# EAGLE design geiger2 (EAGLE 9.4.1)
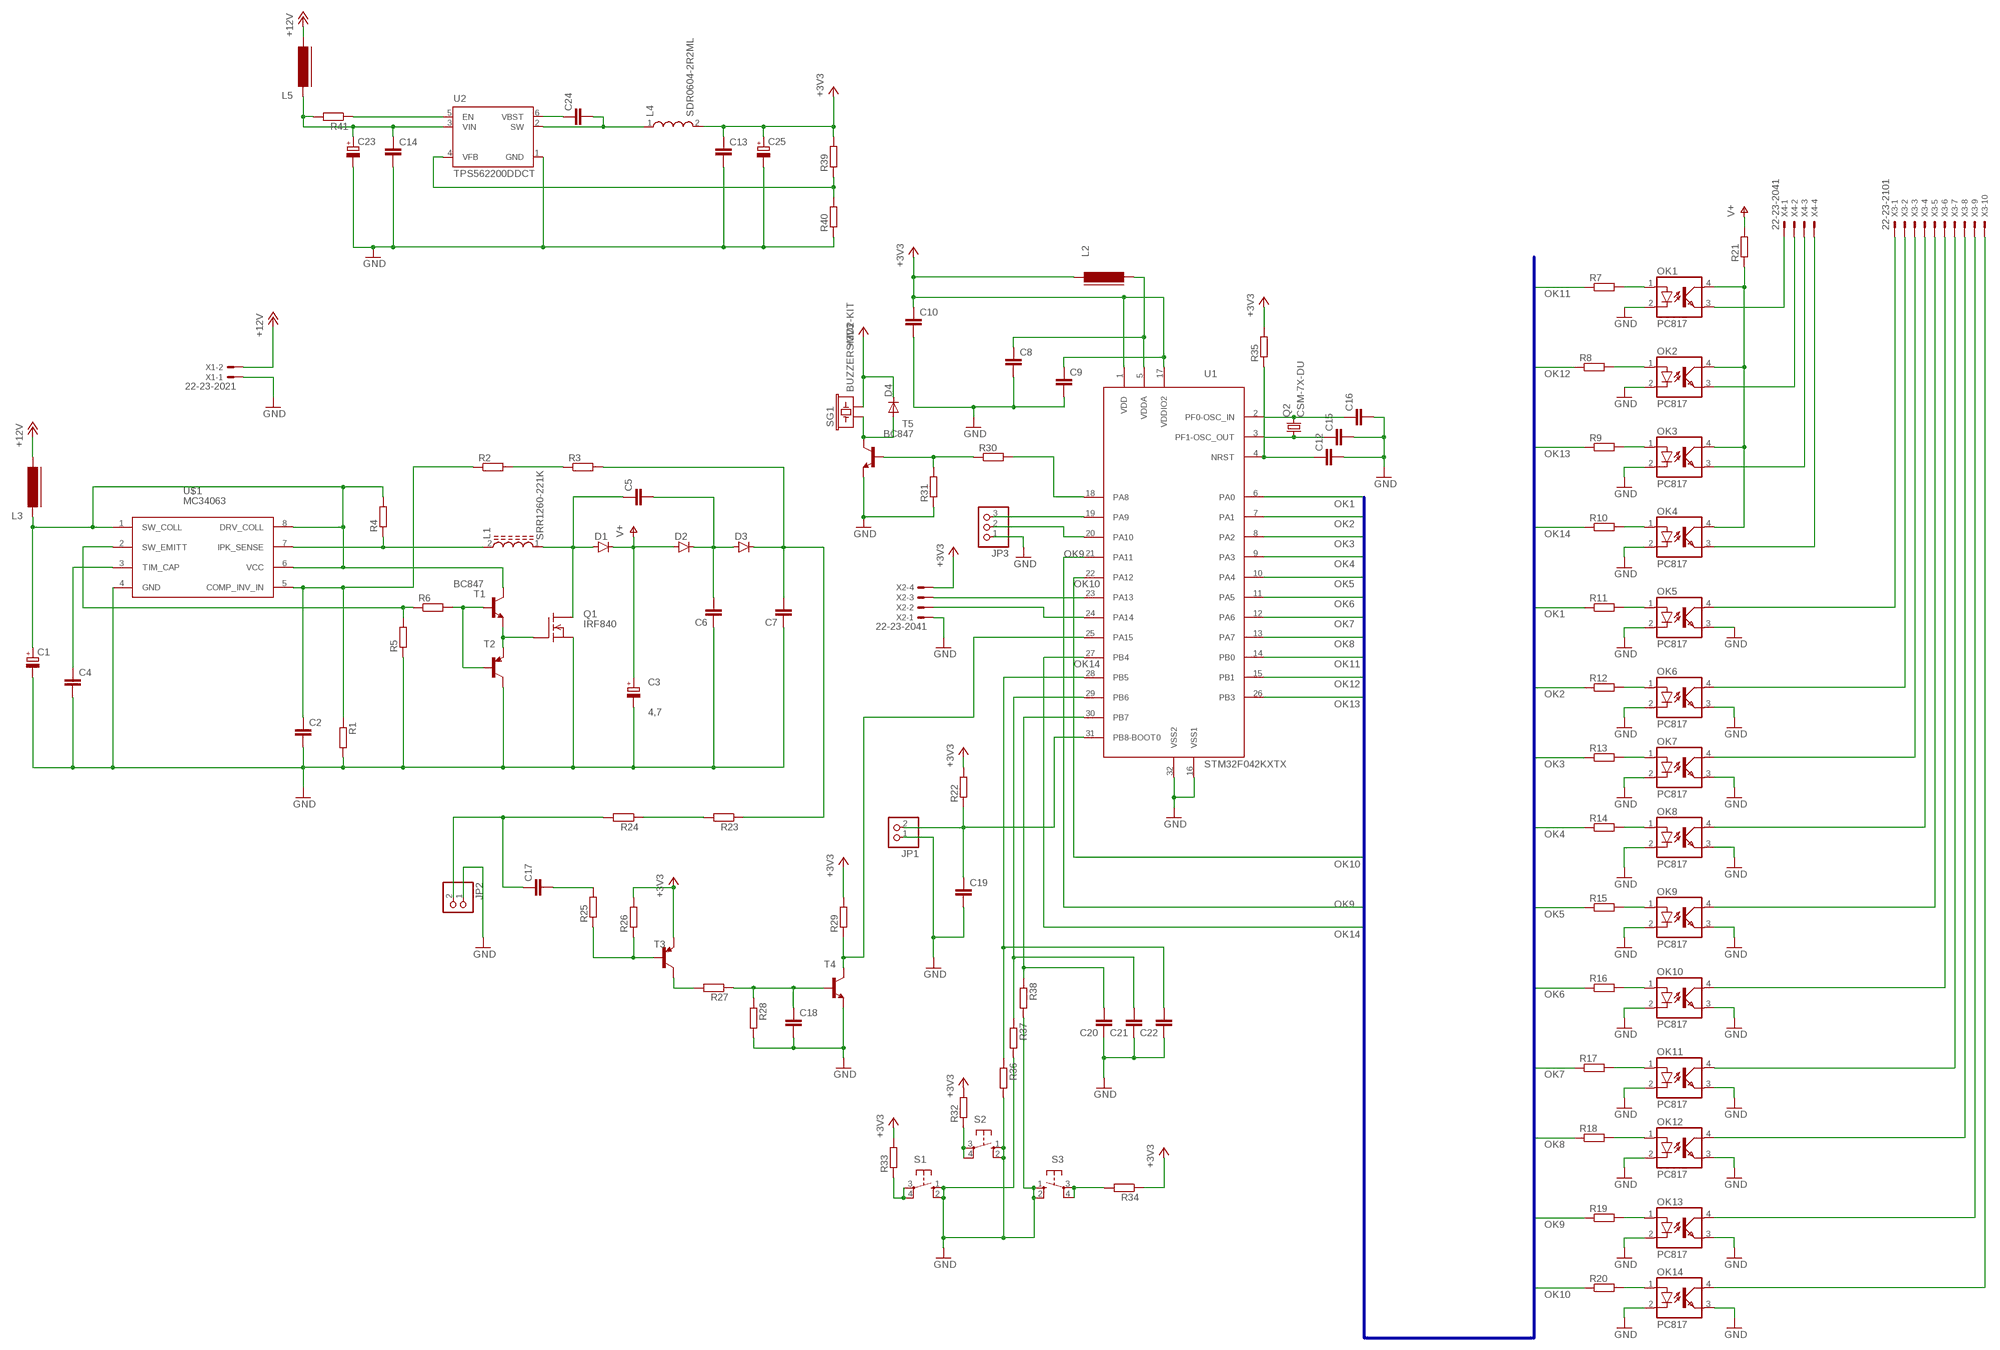
[diagram p0: schematic, sheet 1]

## Parts
C1  CPOL-EUCT7343  [CT7343]
C2  C-EUC0805  [C0805]
C3  4,7  CPOL-EUE5-10.5  [E5-10,5]
C4  C-EUC0805  [C0805]
C5  C-EUC1812K  [C1812K]
C6  C-EUC1812K  [C1812K]
C7  C-EUC1812K  [C1812K]
C8  C-EUC0805  [C0805]
C9  C-EUC0805  [C0805]
C10  C-EUC0805  [C0805]
C12  C-EUC0805  [C0805]
C13  C-EUC0805  [C0805]
C14  C-EUC0805  [C0805]
C15  C-EUC0805  [C0805]
C16  C-EUC0805  [C0805]
C17  C-EUC1206K  [C1206K]
C18  C-EUC0805K  [C0805K]
C19  C-EUC0805K  [C0805K]
C20  C-EUC0805K  [C0805K]
C21  C-EUC0805K  [C0805K]
C22  C-EUC0805K  [C0805K]
C23  CPOL-EUCT7343  [CT7343]
C24  C-EUC0805  [C0805]
C25  CPOL-EUCT7343  [CT7343]
D1  DIODE-DO214AC  [DO214AC]
D2  DIODE-DO214AC  [DO214AC]
D3  DIODE-DO214AC  [DO214AC]
D4  DIODE-SOD-123  [SOD-123]
JP1  PINHD-1X2  [1X02]
JP2  PINHD-1X2  [1X02]
JP3  PINHD-1X3  [1X03]
L1  SRR1260-221K  [INDP125125X600N]
L2  FERRITE-0805  [FB805]
L3  FERRITE-0805  [FB805]
L4  SDR0604-2R2ML  [INDP5858X480N]
L5  FERRITE-0805  [FB805]
OK1  PC817  [DIL04]
OK2  PC817  [DIL04]
OK3  PC817  [DIL04]
OK4  PC817  [DIL04]
OK5  PC817  [DIL04]
OK6  PC817  [DIL04]
OK7  PC817  [DIL04]
OK8  PC817  [DIL04]
OK9  PC817  [DIL04]
OK10  PC817  [DIL04]
OK11  PC817  [DIL04]
OK12  PC817  [DIL04]
OK13  PC817  [DIL04]
OK14  PC817  [DIL04]
Q1  IRF840  [TO220]
Q2  CSM-7X-DU  [CSM-7X-DU]
R1  R-EU_R0805  [R0805]
R2  R-EU_R0805  [R0805]
R3  R-EU_R0805  [R0805]
R4  R-EU_R2512  [R2512]
R5  R-EU_R0805  [R0805]
R6  R-EU_R0805  [R0805]
R7  R-EU_R0805  [R0805]
R8  R-EU_R0805  [R0805]
R9  R-EU_R0805  [R0805]
R10  R-EU_R0805  [R0805]
R11  R-EU_R0805  [R0805]
R12  R-EU_R0805  [R0805]
R13  R-EU_R0805  [R0805]
R14  R-EU_R0805  [R0805]
R15  R-EU_R0805  [R0805]
R16  R-EU_R0805  [R0805]
R17  R-EU_R0805  [R0805]
R18  R-EU_R0805  [R0805]
R19  R-EU_R0805  [R0805]
R20  R-EU_R0805  [R0805]
R21  R-EU_R1206  [R1206]
R22  R-EU_R0805  [R0805]
R23  R-EU_R1206  [R1206]
R24  R-EU_R1206  [R1206]
R25  R-EU_R0805  [R0805]
R26  R-EU_R0805  [R0805]
R27  R-EU_R0805  [R0805]
R28  R-EU_R0805  [R0805]
R29  R-EU_R0805  [R0805]
R30  R-EU_R0805  [R0805]
R31  R-EU_R0805  [R0805]
R32  R-EU_R0805  [R0805]
R33  R-EU_R0805  [R0805]
R34  R-EU_R0805  [R0805]
R35  R-EU_R0805  [R0805]
R36  R-EU_R0805  [R0805]
R37  R-EU_R0805  [R0805]
R38  R-EU_R0805  [R0805]
R39  R-EU_R0805  [R0805]
R40  R-EU_R0805  [R0805]
R41  R-EU_R0805  [R0805]
S1  10-XX  [B3F-10XX]
S2  10-XX  [B3F-10XX]
S3  10-XX  [B3F-10XX]
SG1  BUZZERSMD2-KIT  [BUZZER-CCV-KIT]
T1  BC847  BC847BLT1SMD  [SOT23]
T2  BC857C-PNP-SOT23-BEC  [SOT23-BEC]
T3  BC857A-PNP-SOT23-BEC  [SOT23-BEC]
T4  BC847-NPN-SOT23-BEC  [SOT23-BEC]
T5  BC847  [SOT23]
U1  STM32F042KXTX  [LQFP32]
U2  TPS562200DDCT  [SOT95P280X110-6N]
U$1  MC34063  MC34063/MC33063  [SO-8]
X1  22-23-2021  [22-23-2021]
X2  22-23-2041  [22-23-2041]
X3  22-23-2101  [22-23-2101]
X4  22-23-2041  [22-23-2041]

## Nets
+3V3: C9.1 C10.1 C13.1 C25.+ D4.C L2.1 L4.2 R22.2 R26.2 R29.2 R32.2 R33.2 R34.1 R35.2 R39.2 SG1.- T3.E U1.1(VDD) U1.17(VDDIO2) X2.4
+12V: L3.2 L5.2 X1.2
GND: C1.- C2.2 C3.- C4.2 C6.1 C7.1 C8.2 C9.2 C10.2 C12.2 C13.2 C14.2 C15.2 C16.2 C18.2 C19.2 C20.1 C21.1 C22.1 C23.- C25.- JP1.1 JP2.1 JP3.1 OK1.2(C) OK2.2(C) OK3.2(C) OK4.2(C) OK5.2(C) OK5.3(EMIT) OK6.2(C) OK6.3(EMIT) OK7.2(C) OK7.3(EMIT) OK8.2(C) OK8.3(EMIT) OK9.2(C) OK9.3(EMIT) OK10.2(C) OK10.3(EMIT) OK11.2(C) OK11.3(EMIT) OK12.2(C) OK12.3(EMIT) OK13.2(C) OK13.3(EMIT) OK14.2(C) OK14.3(EMIT) Q1.3(S) R1.2 R5.1 R28.2 R31.1 R36.2 R37.2 R38.2 R40.1 S1.1(S) S1.2(S1) S2.1(S) S2.2(S1) S3.1(S) S3.2(S1) T2.C T4.E T5.2(E) U1.16(VSS1) U1.32(VSS2) U2.1(GND) U$1.4(GND) X1.1 X2.1
N$1: C2.1 R1.1 R2.1 U$1.5(COMP_INV_IN)
N$2: C7.2 D3.C R3.2 R23.1
N$3: R6.2 T1.1(B) T2.B
N$4: R5.2 R6.1 U$1.2(SW_EMITT)
N$5: L1.2 R4.1 U$1.7(IPK_SENSE)
N$6: Q1.1(G) T1.2(E) T2.E
N$7: C5.1 D1.A L1.1 Q1.2(D)
N$8: OK1.3(EMIT) X4.1
N$9: C14.1 C23.+ L5.1 R41.2 U2.3(VIN)
N$10: R2.2 R3.1
N$11: C4.1 U$1.3(TIM_CAP)
N$12: C5.2 C6.2 D2.C D3.A
N$13: C12.1 R35.1 U1.4(NRST)
N$14: OK14.1(A) R20.2
N$15: OK13.1(A) R19.2
N$16: OK12.1(A) R18.2
N$17: OK11.1(A) R17.2
N$18: C1.+ L3.1 R4.2 T1.3(C) U$1.1(SW_COLL) U$1.6(VCC) U$1.8(DRV_COLL)
N$19: OK10.1(A) R16.2
N$20: OK9.1(A) R15.2
N$21: OK8.1(A) R14.2
N$22: OK7.1(A) R13.2
N$23: OK6.1(A) R12.2
N$24: OK5.1(A) R11.2
N$25: OK4.1(A) R10.2
N$26: OK3.1(A) R9.2
N$27: OK2.1(A) R8.2
N$28: OK1.1(A) R7.2
N$29: OK1.4(COL) OK2.4(COL) OK3.4(COL) OK4.4(COL) R21.1
N$30: U1.23(PA13) X2.3
N$31: U1.24(PA14) X2.2
N$32: OK2.3(EMIT) X4.2
N$33: OK3.3(EMIT) X4.3
N$34: OK4.3(EMIT) X4.4
N$35: C15.1 Q2.1 U1.3(PF1-OSC_OUT)
N$36: OK5.4(COL) X3.1
N$37: OK6.4(COL) X3.2
N$39: OK7.4(COL) X3.3
N$40: OK8.4(COL) X3.4
N$41: OK9.4(COL) X3.5
N$42: OK10.4(COL) X3.6
N$43: OK11.4(COL) X3.7
N$44: OK12.4(COL) X3.8
N$45: OK13.4(COL) X3.9
N$46: OK14.4(COL) X3.10
N$47: C16.1 Q2.2 U1.2(PF0-OSC_IN)
N$48: C19.1 JP1.2 R22.1 U1.31(PB8-BOOT0)
N$49: R23.2 R24.1
N$50: C17.1 JP2.2 R24.2
N$51: R27.2 T3.C
N$52: C17.2 R25.2
N$53: R25.1 R26.1 T3.B
N$54: C18.1 R27.1 R28.1 T4.B
N$55: JP3.3 U1.19(PA9)
N$56: JP3.2 U1.20(PA10)
N$57: R29.1 T4.C U1.25(PA15)
N$58: R30.2 U1.18(PA8)
N$59: R30.1 R31.2 T5.1(B)
N$60: R33.1 S1.3(P) S1.4(P1)
N$61: C22.2 R36.1 U1.28(PB5)
N$62: D4.A SG1.+ T5.3(C)
N$63: R32.1 S2.3(P) S2.4(P1)
N$64: R34.2 S3.3(P) S3.4(P1)
N$65: C21.2 R37.1 U1.29(PB6)
N$66: C20.2 R38.1 U1.30(PB7)
N$67: C8.1 L2.2 U1.5(VDDA)
N$68: R41.1 U2.5(EN)
N$71: C24.1 U2.6(VBST)
N$72: C24.2 L4.1 U2.2(SW)
N$73: R39.1 R40.2 U2.4(VFB)
OK1: R11.1 U1.6(PA0)
OK2: R12.1 U1.7(PA1)
OK3: R13.1 U1.8(PA2)
OK4: R14.1 U1.9(PA3)
OK5: R15.1 U1.10(PA4)
OK6: R16.1 U1.11(PA5)
OK7: R17.1 U1.12(PA6)
OK8: R18.1 U1.13(PA7)
OK9: R19.1 U1.21(PA11)
OK10: R20.1 U1.22(PA12)
OK11: R7.1 U1.14(PB0)
OK12: R8.1 U1.15(PB1)
OK13: R9.1 U1.26(PB3)
OK14: R10.1 U1.27(PB4)
V+: C3.+ D1.C D2.A R21.2

## Buses
OK:OK1,OK2,OK3,OK4,OK5,OK6,OK7,OK8,OK9,OK10,OK11,OK12,OK13,OK14

## Library data of the parts
C1 C3 C23 C25 = rcl:CPOL-EU: POLARIZED CAPACITOR, European symbol; SPICEPREFIX: C
C2 C4 C8-C10 C12-C22 C24 = rcl:C-EU: CAPACITOR, European symbol; SPICEPREFIX: C
C5-C7 = rcl:C-EU: CAPACITOR, European symbol
D1-D3 = diode:DIODE-: DIODE
D4 = dp_devices:DIODE: Various Diode Packages
JP1 JP2 = pinhead:PINHD-1X2: PIN HEADER
JP3 = pinhead:PINHD-1X3: PIN HEADER
L1 = SRR1260-221K:SRR1260-221K: Inductor Power Shielded Wirewound 33uH 20% 100KHz 27Q-Factor Ferrite 3A 60mOhm DCR T/R; AVAILABILITY: Unavailable; DESCRIPTION: Inductor Power Shielded Wirewound 220uH 10% 100KHz 22Q-Factor Ferrite 1.38A 380mOhm DCR T/R; MF: Bourns - J.W. Miller; MP: SRR1260-221K; PACKAGE: Nonstandard Bourns - J.W. Miller; PRICE: None
L2 L3 L5 = dp_devices:FERRITE: Ferrite bead in various packages
L4 = SDR0604-2R2ML:SDR0604-2R2ML: Inductor Power Wirewound 120uH 10% 1KHz 22Q-Factor Ferrite 480mA 930mOhm DCR T/R; AVAILABILITY: Unavailable; DESCRIPTION: Inductor Power Wirewound 2.2uH 20% 1KHz 33Q-Factor Ferrite 2.8A 60mOhm DCR T/R; MF: Bourns; MP: SDR0604-2R2ML; PACKAGE: Nonstandard Bourns; PRICE: None
OK1-OK14 = optocoupler:PC817: SHARP OPTO COUPLER; MPN: PC817X4J000F; OC_FARNELL: 9707727; OC_NEWARK: 97K7059
Q1 = transistor-fet:IRF840: N-Channel Enhancement MOSFET (HEXFET); 500V; 8A; 0,85Ohm
Q2 = crystal:CSM-7X-DU: SMD CRYSTAL Source: www.ecsxtal.com .. Crystal 3.6864MHz CSM_7X_DU.PDF; OC_FARNELL: unknown; OC_NEWARK: unknown
R1-R41 = rcl:R-EU_: RESISTOR, European symbol; SPICEPREFIX: R
S1-S3 = switch-omron:10-XX: OMRON SWITCH; MPN: B3F-1000; OC_FARNELL: 176432; OC_NEWARK: 36M3542
SG1 = SparkFun:BUZZER: Buzzer 12mm Spark Fun Electronics SKU : Comp-Buzzer
T1 = transistor-npn:BC847*: NPN Transistor
T2 = transistor-neu-to92:*-PNP-: PNP Transistror
T3 = transistor:*-PNP-: PNP Transistror
T4 = transistor:*-NPN-: NPN Transistror BF959 corrected 2008.03.06
T5 = transistor-neu-to92:BC847: NPN TRANSISTOR
U1 = stm32f0:STM32F042KXTX
U2 = TPS562200DDCT:TPS562200DDCT: 17 V Input, 2A Synchronous Step-Down Regulator in SOT-23 with Advanced Eco-mode? 6-SOT -40 to 125; AVAILABILITY: Unavailable; DESCRIPTION: 17 V Input, 2A Synchronous Step-Down egulator in SOT-23 with Advanced Eco-mode? 6-SOT -40 to 85; MF: Texas Instruments; MP: TPS562200DDCT; PACKAGE: TSOT-23-6 Texas Instruments; PRICE: None
U$1 = voltage_regulators:MC34063/MC33063
X1 = con-molex:22-23-2021: .100" (2.54mm) Center Header - 2 Pin; MF: MOLEX; MPN: 22-23-2021; OC_FARNELL: 1462926; OC_NEWARK: 25C3832
X2 X4 = con-molex:22-23-2041: .100" (2.54mm) Center Header - 4 Pin; MF: MOLEX; MPN: 22-23-2041; OC_FARNELL: 1462920; OC_NEWARK: 38C0355
X3 = con-molex:22-23-2101: .100" (2.54mm) Center Header - 10 Pin; MF: MOLEX; MPN: 22-23-2101; OC_FARNELL: 1756828; OC_NEWARK: 94C0765

## Board
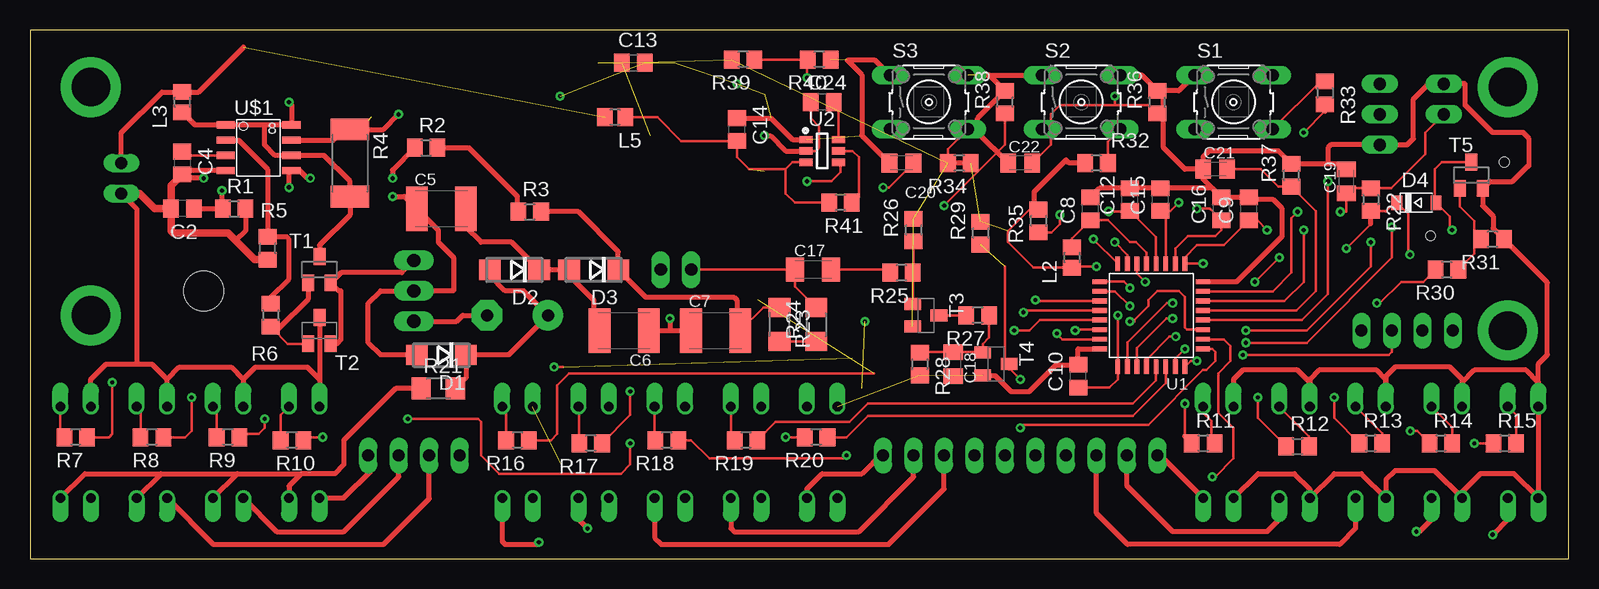
[diagram p1: board, top side]
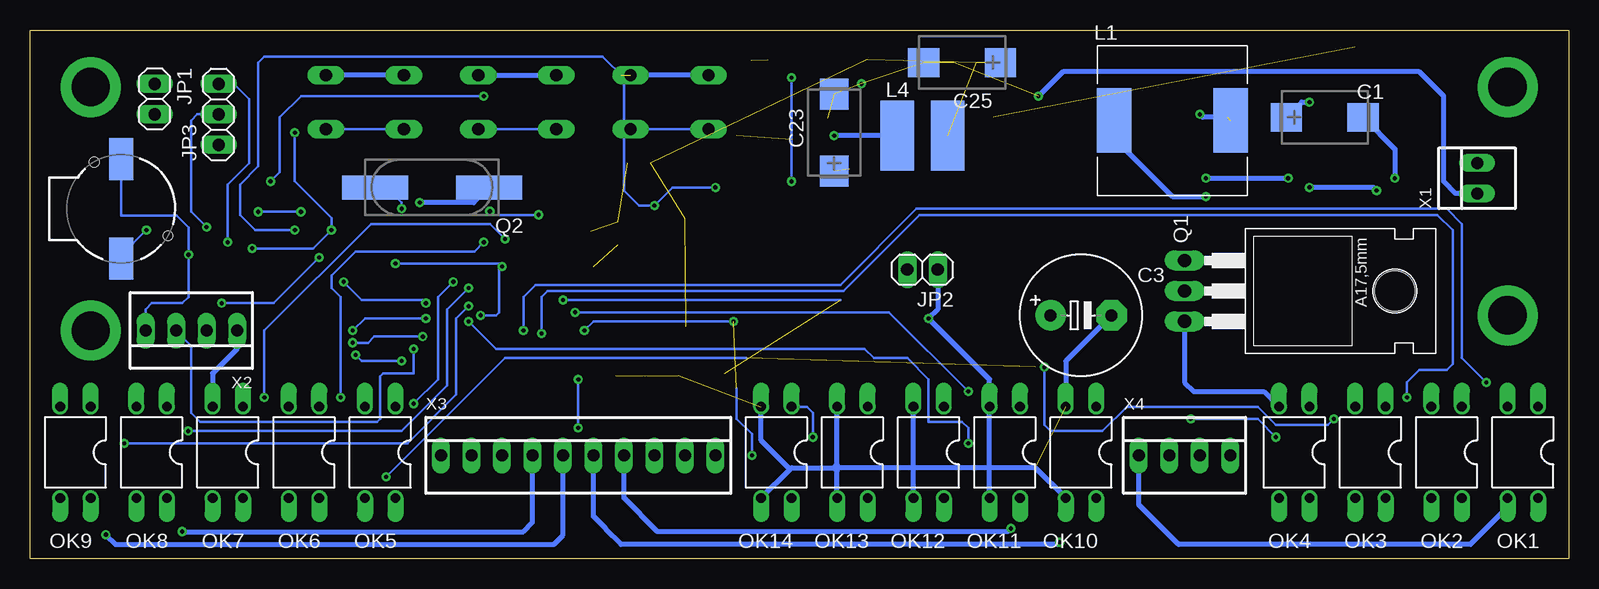
[diagram p2: board, bottom side, seen from below]

Size 128.25 x 44.12 mm. Coordinates in mm from the lower left corner, seen from the top.
Outline: 0,0 128.25,0 128.25,44.12 0,44.12 0,0
Copper layers (1*16): Top 0.035mm / dielectric 1.5mm / Bottom 0.035mm
Design rules "default": minimum track width 6mil, minimum drill 0.35mm, track to track 6mil, track to pad 6mil, pad to pad 6mil, via to via 6mil, smd to smd 6mil, copper to edge 40mil, drill to drill 6mil, minimum pad ring 10mil, minimum via ring 8mil, stop-mask expansion 4mil, vias tented up to drill 0mil, thermal gap 10mil

### Footprints (pad centres in the part's own frame; a part is rotated, then mirrored left to right if it is on the bottom)
CT7343 = smd 2.6 x 2.4: + -3.2,0; - 3.2,0
C0805 = smd 1.3 x 1.5: 1 -0.95,0; 2 0.95,0
E5-10,5 = drill 1.016 pad 2.54: + -2.54,0 | drill 1.016 pad 2.54 octagon: - 2.54,0
C1812K = smd 1.8 x 3.7: 1 -2.05,0; 2 2.05,0
C1206K = smd 1.5 x 2: 1 -1.5,0; 2 1.5,0
C0805K = smd 1.3 x 1.6: 1 -1,0; 2 1,0
DO214AC = smd 1.8 x 1.7: A 2.05,0; C -2.05,0
SOD-123 = smd 0.91 x 1.22: A 1.635,0; C -1.635,0
1X02 = drill 1.016 long: 1 -1.27,0; 2 1.27,0
1X03 = drill 1.016 long: 1 -2.54,0; 2 0,0; 3 2.54,0
INDP125125X600N = smd 2.9 x 5.4: 1 -4.85,0; 2 4.85,0
FB805 = smd 1.3 x 1.5: 1 -0.85,0; 2 0.85,0
INDP5858X480N = smd 2.8 x 5.85: 1 -2.1,0; 2 2.1,0
DIL04 = drill 0.813 offset: 1 -1.27,-3.81; 2 1.27,-3.81; 3 1.27,3.81; 4 -1.27,3.81
TO220 = drill 1.118 long: 1 -2.54,-6.35; 2 0,-6.35; 3 2.54,-6.35 | hole 3.302: 0,11.176
CSM-7X-DU = smd 5.5 x 2: 1 -4.75,0; 2 4.75,0
R0805 = smd 1.3 x 1.5: 1 -0.95,0; 2 0.95,0
R2512 = smd 1.8 x 3.2: 1 -2.8,0; 2 2.8,0
R1206 = smd 1.6 x 1.803: 1 -1.422,0; 2 1.422,0
B3F-10XX = drill 1.016 long: 1 -3.251,2.261; 2 3.251,2.261; 3 -3.251,-2.261; 4 3.251,-2.261
BUZZER-CCV-KIT = smd 3.5 x 2: + 4.15,0; - -4.15,0 | hole 0.8: -3.9,-2.25; 2.25,3.9
SOT23 = smd 1 x 1.4: 1 -0.95,-1.1; 2 0.95,-1.1; 3 0,1.1
SOT23-BEC = smd 1 x 1.4: B -0.95,-1.1; C 0,1.1; E 0.95,-1.1
LQFP32 = smd 0.4 x 1.2: 1 -2.8,-4.3; 2 -2,-4.3; 3 -1.2,-4.3; 4 -0.4,-4.3; 5 0.4,-4.3; 6 1.2,-4.3; 7 2,-4.3; 8 2.8,-4.3; 17 2.8,4.3; 18 2,4.3; 19 1.2,4.3; 20 0.4,4.3; 21 -0.4,4.3; 22 -1.2,4.3; 23 -2,4.3; 24 -2.8,4.3 | smd 1.2 x 0.4: 9 4.3,-2.8; 10 4.3,-2; 11 4.3,-1.2; 12 4.3,-0.4; 13 4.3,0.4; 14 4.3,1.2; 15 4.3,2; 16 4.3,2.8; 25 -4.3,2.8; 26 -4.3,2; 27 -4.3,1.2; 28 -4.3,0.4; 29 -4.3,-0.4; 30 -4.3,-1.2; 31 -4.3,-2; 32 -4.3,-2.8
SOT95P280X110-6N = smd 1.1 x 0.6: 1 -1.35,0.95; 2 -1.35,0; 3 -1.35,-0.95; 4 1.35,-0.95; 5 1.35,0; 6 1.35,0.95
SO-8 = smd 1.524 x 0.61: 1 -2.743,1.905; 2 -2.743,0.635; 3 -2.743,-0.635; 4 -2.743,-1.905; 5 2.743,-1.905; 6 2.743,-0.635; 7 2.743,0.635; 8 2.743,1.905
22-23-2021 = drill 1 long: 1 -1.27,0; 2 1.27,0
22-23-2041 = drill 1 long: 1 -3.81,0; 2 -1.27,0; 3 1.27,0; 4 3.81,0
22-23-2101 = drill 1 long: 1 -11.43,0; 2 -8.89,0; 3 -6.35,0; 4 -3.81,0; 5 -1.27,0; 6 1.27,0; 7 3.81,0; 8 6.35,0; 9 8.89,0; 10 11.43,0

### Placement (x,y rotation side)
C1  20.32,36.83 0 bottom
C2  12.7,29.21 180 top
C3  40.64,20.32 0 bottom
C4  12.7,33.02 270 top
C5  34.29,29.21 0 top
C6  49.53,19.05 180 top
C7  57.15,19.05 0 top
C8  88.39,29.21 90 top
C9  101.6,29.21 90 top
C10  87.38,15.24 90 top
C12  91.69,29.97 90 top
C13  50.29,41.4 0 top
C14  58.93,35.81 90 top
C15  94.23,29.97 90 top
C16  99.31,29.21 90 top
C17  65.28,24.13 0 top
C18  76.96,16.26 270 top
C19  109.73,31.5 90 top
C20  72.64,33.02 0 top
C21  98.81,32.51 0 top
C22  82.55,33.02 0 top
C23  61.21,35.56 90 bottom
C24  66.04,38.1 180 top
C25  50.55,41.4 180 bottom
D1  34.29,17.02 180 top
D2  40.39,24.13 180 top
D3  46.99,24.13 180 top
D4  115.57,29.72 0 top
JP1  117.86,38.35 270 bottom
JP2  53.85,24.13 180 bottom
JP3  112.52,37.08 90 bottom
L1  33.02,36.58 0 bottom
L2  86.87,25.15 90 top
L3  12.7,38.1 90 top
L4  53.85,35.31 0 bottom
L5  48.77,36.83 180 top
OK1  3.81,8.89 180 bottom
OK2  10.16,8.89 180 bottom
OK3  16.51,8.89 180 bottom
OK4  22.86,8.89 180 bottom
OK5  99.06,8.89 180 bottom
OK6  105.41,8.89 180 bottom
OK7  111.76,8.89 180 bottom
OK8  118.11,8.89 180 bottom
OK9  124.46,8.89 180 bottom
OK10  40.64,8.89 180 bottom
OK11  46.99,8.89 180 bottom
OK12  53.34,8.89 180 bottom
OK13  59.69,8.89 180 bottom
OK14  66.04,8.89 180 bottom
Q1  25.65,22.35 270 bottom
Q2  94.74,30.99 180 bottom
R1  17.02,29.21 0 top
R2  33.02,34.29 0 top
R3  41.66,28.96 0 top
R4  26.67,33.02 270 top
R5  19.81,25.91 90 top
R6  20.07,20.32 270 top
R7  3.81,10.16 180 top
R8  10.16,10.16 180 top
R9  16.51,10.16 180 top
R10  21.84,9.91 180 top
R11  97.79,9.65 0 top
R12  105.66,9.4 0 top
R13  111.76,9.65 0 top
R14  117.6,9.65 0 top
R15  122.94,9.65 0 top
R16  40.64,9.91 180 top
R17  46.74,9.65 180 top
R18  53.09,9.91 180 top
R19  59.69,9.91 180 top
R20  65.53,10.16 180 top
R21  34.04,14.22 0 top
R22  111.76,29.97 270 top
R23  62.48,19.56 270 top
R24  65.53,19.56 90 top
R25  72.64,23.88 180 top
R26  73.66,27.43 90 top
R27  78.99,20.32 180 top
R28  74.17,16.26 270 top
R29  79.25,27.18 90 top
R30  118.11,24.13 180 top
R31  121.92,26.67 180 top
R32  88.9,33.02 180 top
R33  107.95,38.86 270 top
R34  77.47,33.02 180 top
R35  84.07,28.19 90 top
R36  93.98,38.1 90 top
R37  105.16,32 90 top
R38  81.28,38.1 90 top
R39  59.44,41.66 180 top
R40  65.79,41.66 180 top
R41  67.56,29.72 180 top
S1  100.33,38.1 0 top
S2  87.63,38.1 0 top
S3  74.93,38.1 0 top
SG1  120.65,29.21 270 bottom
T1  24.13,24.13 0 top
T2  24.13,19.05 0 top
T3  74.68,20.32 270 top
T4  80.52,16.26 270 top
T5  120.14,32 0 top
U1  93.47,20.32 180 top
U2  66.04,34.04 0 top
U$1  19.05,34.29 0 top
X1  7.62,31.75 90 bottom
X2  114.81,19.05 180 bottom
X3  82.55,8.64 0 bottom
X4  32,8.64 0 bottom

### Tracks (layer width: path | path; a pad name or v marks a point on that pad's centre or on a via)
+3V3  (via drill 0.35)  (8 unrouted)
  Top 0.203: U1.17 90.67,14.98 89.98,14.29 C10.1 | 86.96,24.38 v88.9,24.38 | 97.77,24.62 U1.1 96.27,25.15 97.28,26.16 99.5,26.16 C9.1 102.3,28.26 v103.12,27.43 | v90.68,20.32 U1.17 | D4.C 114.88,28.78 114.88,25.53 v115.04,25.37 | R22.2 112.96,29.02 113.03,28.96 113.79,29.72 | v109.73,25.91 111.76,27.94 | 107.95,37.34 v106.17,35.56 | 83.69,29.52 81.53,27.37 81.53,26.42 83.65,24.3 L2.1
  Top 0.406: R34.1 76.52,33.02 | 87.95,32.92 R32.2 86.61,33.02 86.36,33.27 83.69,30.61 83.69,29.52 R35.2 | L2.1 86.96,24.38 | v97.79,24.64 97.77,24.62 | U1.17 | 113.79,29.72 D4.C | 111.76,27.94 R22.2 | R33.2 107.95,37.34
  Bottom 0.203: v97.79,24.64 89.15,24.64 v88.9,24.38 89.15,24.13 89.15,20.57 89.41,20.32 v90.68,20.32 | X2.4 118.62,20.83 118.11,21.34 115.57,21.34 115.04,21.87 v115.04,25.37 115.04,27.66 116.02,28.64 120.65,28.64 SG1.- | v109.73,25.91 104.65,25.91 v103.12,27.43 103.12,28.45 106.17,31.5 v106.17,35.56
  Bottom 0.406: 46.74,40.79 C25.+
+12V  (1 unrouted)
  Top 0.406: X1.2 7.62,35.56 11.01,38.95 L3.2 14.06,38.95 17.8,42.7
GND  (via drill 0.35)  (12 unrouted)
  Top 0.406: U$1.4 13.02,32.38 12.79,32.16 | 12.79,32.16 C4.2 | v14.48,31.75 13.21,31.75 12.79,32.16 | R1.2 17.97,27.37 17.14,26.54 | Q1.3 35.56,19.81 36.07,20.32 C3.- | 24.13,14.99 OK4.2 | C6.1 53.34,19.05 | 53.34,19.05 C7.1 | S3.1 70.45,41.59 68.14,41.59 69.34,40.39 69.34,35.32 C20.1 | S3.2 79.97,40.36 R38.2 78.99,36.76 78.99,35.58 C22.1 | 78.99,40.36 S2.1 | S2.2 92.67,40.36 R36.2 94.49,39.05 | S1.1 95.77,39.05 94.49,39.05 | C21.1 97.81,31.67 C16.2 | C21.1 96.27,32.51 94.49,34.29 94.49,39.05 | OK1.2 5.08,14.99 6.35,16.26 8.89,16.26 | 8.89,16.26 10.16,16.26 11.43,14.99 | OK2.2 11.43,14.99 | 11.43,14.99 12.45,16 16.76,16 17.78,14.99 | 17.78,14.99 OK3.2 | 17.78,14.99 18.8,16 23.11,16 24.13,14.99 | OK9.2 125.73,14.73 124.71,15.75 120.4,15.75 119.38,14.73 OK8.2 119.38,14.99 118.36,16 113.79,16 113.03,15.24 OK7.2 113.03,14.99 112.27,15.75 107.44,15.75 106.68,14.99 OK6.2 106.68,14.73 105.66,15.75 101.09,15.75 100.33,14.99 OK5.2 | OK9.2 OK9.3 123.7,7.11 120.9,7.11 119.38,5.59 OK8.3 117.09,7.37 113.79,7.37 113.03,6.6 OK7.3 111,7.11 108.71,7.11 OK6.3 106.68,5.84 105.41,7.11 102.36,7.11 OK5.3 | C8.2 89.15,30.92 C12.2 C15.2 98.55,30.92 C16.2 | C9.2 101.35,30.16 | 101.35,30.16 C16.2 | U1.16 87.37,17.52 C10.2 | U1.32 100.59,23.12 104.39,26.92 104.39,29.21 103.63,29.97 101.53,29.97 101.35,30.16 | T4.E 80.45,15.31 81.79,13.97 83.31,13.97 85.54,16.2 C10.2 | C10.2 | OK9.2 125.73,16.26 126.49,17.02 126.49,23.05 R31.1 121.98,27.56 121.98,28.58 121.09,29.47 T5.2 121.68,31.49 123.57,31.49 124.85,32.77 124.97,32.77 124.97,35.05 124.46,35.56 121.92,35.56 119.63,37.85 119.63,39.62 JP1.1 116.59,39.62 115.32,38.35 115.32,35.05 114.81,34.54 JP3.1 108.46,34.54 108.2,34.29 108.2,33.02 108.27,32.95
  Top 0.406: 108.27,32.95 R37.2 104.07,34.04 98.3,34.04 97.79,33.53 97.79,32.53 C21.1 | C19.2 109.27,32.95 108.27,32.95 | v53.34,20.07 53.34,19.05 | T2.C 24.13,14.99 | X1.1 8.89,29.21 8.89,16.26 | C14.2 61.79,36.76 63.57,34.99 U2.1
  Top 0.61: R5.1 18.73,24.96 17.14,26.54 16.51,27.18 11.94,27.18 11.75,27.37 C2.2 | X1.1 9.14,30.48 10.41,29.21 C2.2 | C2.2 11.75,31.12 C4.2
  Bottom 0.406: C1.- 14.48,34.19 v14.48,31.75 | S3.1 S3.2 | S1.1 S1.2 | S1.2 103.91,40.36 104.14,40.13 103.81,40.13 S1.2 | S2.2 S2.1 | OK10.3 44.45,7.62 48.26,7.62 | OK14.3 64.9,7.49 | 64.9,7.49 64.77,7.62 61.21,7.62 | 48.26,7.62 54.61,7.62 | 54.61,7.62 61.21,7.62 | OK13.3 60.96,7.37 61.21,7.62 | OK12.3 54.61,7.62 | OK11.3 48.26,7.62 | 61.21,7.62 60.96,7.87 OK13.2 | 64.9,7.49 67.31,9.91 OK14.2 | 54.61,7.62 OK12.2 | 48.26,7.62 OK11.2 48.26,14.99 v53.34,20.07 52.58,20.83 JP2.1 | X2.1 111,17.53 113.03,15.49 OK7.2 | C3.- 41.91,16.51 OK10.2 | X1.1 9.4,30.48 10.41,31.5 10.41,38.61 12.45,40.64 42.16,40.64 v44.2,38.61 | Q1.3 32,14.73 31.24,13.97 25.4,13.97 OK4.2
  other vias: 58.93,39.62
N$1  (via drill 0.35)
  Top 0.406: R2.1 30.23,32.45 v30.23,31.75 | v23.37,31.75 23.11,31.75 22.48,32.38 U$1.5 21.59,32.18 v21.59,30.99 | C2.1 R1.1 16,29.28 v16,30.73
  Bottom 0.406: v30.23,31.75 v23.37,31.75 | v16,30.73 16.26,30.99 v21.59,30.99
N$2
  Top 0.203: C7.2 61.13,20.98 R23.1
  Top 0.406: C7.2 58.93,19.32 58.93,21.59 58.67,21.84 51.33,21.84 D3.C 49.04,25.64 45.72,28.96 R3.2
N$3
  Top 0.203: 20.23,19.21 21.49,17.95 T2.B
  Top 0.406: R6.2 20.23,19.21 20.73,19.21 23.18,21.66 T1.1
N$4
  Top 0.406: U$1.2 17.4,34.92 19.81,32.51 R5.2 21.4,26.86 21.59,26.67 21.59,23.37 20.07,21.84 R6.1
N$5  (via drill 0.35)  (1 unrouted)
  Top 0.406: U$1.7 25.27,34.92 25.91,35.56 26.41,35.56 | R4.1 26.41,35.56 | R4.1 26.93,35.56 | 26.93,35.56 27.69,35.56 | 26.93,35.56 26.41,35.56 | R4.1 29.47,35.82 v30.73,37.08
  Bottom 0.406: 28.7,37.08 28.45,36.83 30.48,36.83 v30.73,37.08 | L1.2 27.69,36.58
N$6
  Top 0.406: T2.E 25.57,17.95 25.91,18.29 25.91,22.35 25.76,22.35 T1.2 25.93,23.88 30.99,23.88 Q1.1
N$7  (via drill 0.35)
  Top 0.406: v30.23,30.23 31.22,30.23 C5.1 34.04,27.41 34.04,26.42 35.31,25.15 35.31,22.35 Q1.2 29.21,22.35 28.19,21.34 28.19,18.03 29.21,17.02 D1.A
  Bottom 0.406: L1.1 37.87,35.08 33.02,30.23 v30.23,30.23
N$8
  Bottom 0.406: OK1.3 5.33,4.83 5.33,4.06 8.18,1.22 32.51,1.22 35.81,4.52 X4.1
N$9  (1 unrouted)
  Top 0.203: U2.3 63.57,33.09 62.99,32.51 | 62.99,32.51 62.99,30.48 63.75,29.72 R41.2 | 62.99,32.51 59.94,32.51 58.93,33.53 C14.1 54.29,34.86 52.32,36.83 L5.1
N$10
  Top 0.406: R2.2 36.58,34.29 40.64,30.23 40.64,29.02 R3.1
N$11
  Top 0.203: U$1.3 13.02,33.66
  Top 0.406: 13.02,33.66 C4.1
N$12
  Top 0.406: 36.58,29.21 C5.2 36.32,29.19 36.32,27.69 37.59,26.42 40.13,26.42 42.42,24.13 D2.C D3.A 44.94,23.64 46.99,21.59 46.99,19.05 C6.2
N$13  (via drill 0.35)
  Top 0.203: U1.4 93.87,26.84 C12.1 | v89.92,28.99 91.67,28.99 | R35.1 85.16,27.24 85.85,27.94 v85.85,28.7
  Top 0.406: 91.67,28.99 C12.1
  Bottom 0.203: v85.85,28.7 89.66,28.7 89.92,28.96
  Bottom 0.406: 89.92,28.96 v89.92,28.99
N$14  (via drill 0.35)
  Top 0.203: R20.2 v62.99,10.16
  Bottom 0.203: v62.99,10.16 62.99,12.19 63.5,12.7 OK14.1
N$15
  Top 0.203: 58.42,10.23 OK13.1
  Top 0.406: R19.2 58.42,10.23
N$16
  Top 0.203: 52.07,9.97 OK12.1
  Top 0.406: R18.2 52.07,9.97
N$17
  Top 0.203: R17.2 45.79,12.63 OK11.1
N$18  (via drill 0.35)
  Top 0.406: v21.59,38.1 21.79,37.9 U$1.8 19.56,36.2 | L3.1 13.76,36.2 U$1.1 19.56,36.2 | 19.56,36.2 19.56,34.54 20.45,33.66 U$1.6 24.51,33.66 26.67,31.5 R4.2 26.67,28.7 24.13,26.16 T1.3
  Bottom 0.406: C1.+ 22.25,38.1 v21.59,38.1
N$19
  Top 0.203: R16.2 39.69,12.38 OK10.1
N$20
  Top 0.203: R15.2 123.89,12 OK9.1
N$21
  Top 0.203: R14.2 118.55,10.99 OK8.1
N$22
  Top 0.203: OK7.1 110.62,12.57 110.81,12.38 112.71,10.48 R13.2
N$23
  Top 0.203: 104.46,12.38 OK6.1 106.61,10.23 R12.2
N$24
  Top 0.203: 98.11,12.38 OK5.1 97.79,12.19 98.49,11.5 98.49,10.16
  Top 0.406: R11.2 98.74,9.91 98.49,10.16
N$25
  Top 0.203: OK4.1 20.89,12 R10.2
N$26
  Top 0.203: OK3.1 15.56,12.38 R9.2
N$27
  Top 0.203: OK2.1 9.21,12.38 R8.2
N$28
  Top 0.203: OK1.1 2.54,10.48
  Top 0.406: 2.54,10.48 R7.2
N$29
  Top 0.406: R21.1 30.48,14.22 26.16,9.91 26.16,7.87 25.4,7.11 22.61,7.11 | 22.61,7.11 21.59,6.1 OK4.4 | OK1.4 4.57,7.11 10.92,7.11 | 10.92,7.11 17.27,7.11 | 17.27,7.11 22.61,7.11 | OK2.4 10.92,7.11 | OK3.4 17.27,7.11
N$30  (via drill 0.35)
  Top 0.203: v96.27,17.53 95.47,16.73 U1.23
  Bottom 0.203: X2.3 114.81,17.78 114.81,12.19 114.05,11.43 99.31,11.43 99.06,11.68 99.06,15.24 98.81,15.49 96.27,15.49 v96.27,17.53
N$31  (via drill 0.35)
  Top 0.203: U1.24 96.76,16.51 v97.28,16.51 | X2.2 113.54,17.27 113.28,17.02 v101.09,17.02
  Bottom 0.203: v97.28,16.51 100.58,16.51 v101.09,17.02
N$32
  Top 0.406: OK2.3 15.29,1.22 29.46,1.22 33.27,5.03 X4.2
N$33
  Top 0.406: OK3.3 20.57,2.29 26.16,2.29 30.73,6.86 X4.3
N$34
  Top 0.406: OK4.3 26.16,5.08 28.45,7.37 28.45,8.38 X4.4
N$35  (via drill 0.35)
  Top 0.203: 94.67,28.58 U1.3 | v95.76,29.72 95.06,29.02 C15.1
  Top 0.406: C15.1 94.67,28.58
  Bottom 0.406: Q2.1 91.26,29.72 v95.76,29.72
N$36
  Top 0.406: OK5.4 94.23,8.64 X3.1
N$37
  Top 0.406: OK6.4 104.14,3.3 103.12,2.29 95.25,2.29 91.44,6.1 X3.2
N$39
  Top 0.406: OK7.4 110.49,2.54 109.17,1.22 91.49,1.22 88.9,3.81 X3.3
N$40  (via drill 0.35)
  Top 0.406: OK8.4 116.84,3.3 115.82,2.29 v115.57,2.29
  Bottom 0.406: v115.57,2.29 87.12,2.29 86.36,3.05 X3.4
N$41  (via drill 0.35)
  Top 0.406: OK9.4 123.19,3.3 v121.92,2.03
  Bottom 0.406: v121.92,2.03 121.11,1.22 84.58,1.22 83.82,1.98 X3.5
N$42  (via drill 0.35)
  Top 0.406: OK10.4 39.37,1.47 39.62,1.22 42.42,1.22 v42.42,1.39
  Bottom 0.406: v42.42,1.39 42.59,1.22 78.99,1.22 80.26,2.49 80.26,2.54 81.28,3.56 X3.6
N$43  (via drill 0.35)
  Top 0.406: OK11.4 45.72,3.3 v46.48,2.54
  Bottom 0.406: v46.48,2.54 46.74,2.29 75.95,2.29 78.74,5.08 X3.7
N$44
  Top 0.406: OK12.4 52.07,1.78 52.63,1.22 71.58,1.22 76.2,5.84 X3.8
N$45
  Top 0.406: OK13.4 58.42,2.54 58.67,2.29 69.09,2.29 73.66,6.86 X3.9
N$46
  Top 0.406: OK14.4 64.77,5.84 66.04,7.11 69.34,7.11 71.12,8.89 X3.10 71.12,7.62
N$47  (via drill 0.35)
  Top 0.203: U1.2 95.47,25.88 96.52,26.92 98.81,26.92 99.31,27.43 C16.1 98.42,29.15 98.36,29.21 v97.28,29.21
  Bottom 0.203: v97.28,29.21 97.28,29.72 98.55,30.99
  Bottom 0.406: 98.55,30.99 Q2.2
N$48  (via drill 0.35)
  Top 0.203: U1.31 103.6,22.32 105.16,23.88 105.16,28.45 v105.66,28.96 | v109.22,28.96 109.73,28.96 C19.1 | 110,30.5 110.42,30.92 R22.1 113.47,30.92 116.33,33.78 116.33,35.56 JP1.2
  Top 0.406: C19.1 110,30.5
  Bottom 0.203: v105.66,28.96 v109.22,28.96
N$49
  Top 0.203: R23.2 R24.1
N$50
  Top 0.203: R24.2 63.78,22.73 C17.1 JP2.2
N$51
  Top 0.203: T3.C R27.2
N$52
  Top 0.203: C17.2 71.44,24.13 R25.2
N$53
  Top 0.203: R26.1 73.66,23.94 R25.1 73.59,21.29 T3.B
N$54
  Top 0.203: R27.1 79.94,18.48 79.42,17.95 T4.B 79.37,17.26 C18.1 74.22,17.26 R28.1
N$55  (via drill 0.35)
  Top 0.203: U1.19 92.27,17.6 94.74,20.07 v95.25,20.07 | v101.35,19.05 106.43,19.05 111.76,24.38 v111.76,26.42
  Bottom 0.203: 95.5,20.07 100.33,20.07 v101.35,19.05 | v111.76,26.42 111.76,31.24 109.98,33.02 109.98,38.35 111.25,39.62 JP3.3
  Bottom 0.406: v95.25,20.07 95.5,20.07
N$56  (via drill 0.35)
  Top 0.203: v95.5,18.54 95,18.54 93.07,16.62 | v101.35,18.03 106.43,18.03 113.54,25.15 v113.54,27.69
  Top 0.406: U1.20 93.07,16.62
  Bottom 0.203: v95.5,18.54 99.57,18.54 100.08,18.03 v101.35,18.03 | v113.54,27.69 114.81,28.96 114.81,36.58 114.3,37.08 JP3.2
N$57  (via drill 0.35)  (1 unrouted)
  Top 0.203: v82.55,10.92 82.8,11.18 93.22,11.18 97.79,15.75 98.04,15.75 98.81,16.51 98.81,17.27 98.56,17.52 U1.25 | 81.28,24.38 81.28,16.59 | 81.62,15.92 v82.55,14.99
  Top 0.406: 81.28,16.59 T4.C 81.62,15.92
  Bottom 0.203: v82.55,10.92 v82.55,14.99
N$58  (via drill 0.35)
  Top 0.203: U1.18 91.47,18.04 94.77,21.34 v95.25,21.34 | R30.2 116.14,23.11 114.3,23.11 112.52,21.34 v112.27,21.34 | v104.14,25.15 v102.11,23.11
  Bottom 0.203: v112.27,21.34 107.95,21.34 v104.14,25.15 | v102.11,23.11 100.58,21.59 95.5,21.59 v95.25,21.34
N$59
  Top 0.203: T5.1 119.19,29.4 120.4,28.19 120.4,26.1 | R30.1 120.4,25.47 120.4,26.1 | R31.2 120.4,26.1
N$60
  Top 0.203: R33.1 107.55,39.81 S1.4
  Bottom 0.203: S1.3 S1.4
N$61  (via drill 0.35)
  Top 0.203: C22.2 85.09,34.56 85.09,37.08 85.85,37.85 90.42,37.85 | R36.1 93.28,37.85 90.42,37.85 | U1.28 106.03,19.92 108.2,22.1 v108.2,31.5 | v90.42,38.61 90.42,37.85
  Bottom 0.203: v108.2,31.5 107.44,32.26 107.44,36.83 105.66,38.61 v90.42,38.61
N$62  (via drill 0.35)
  Top 0.203: 117.09,29.83 117.09,32.51 117.69,33.1 T5.3 | v118.54,27.43 118.36,27.61 118.36,28.56 D4.A
  Top 0.406: D4.A 117.09,29.83
  Bottom 0.203: v118.54,27.43 120.65,25.33
  Bottom 0.406: 120.65,25.33 SG1.+
N$63
  Top 0.203: S2.4 89.85,34.81 R32.1
  Bottom 0.203: S2.3 S2.4
N$64
  Top 0.203: S3.4 76.52,34.18 R34.2
  Bottom 0.203: S3.4 S3.3
N$65
  Top 0.203: U1.29 105.56,20.72 107.19,22.35 107.19,29.02 R37.1 104.07,31.05 102.62,32.51 C21.2
N$66  (via drill 0.35)
  Top 0.203: v76.2,29.46 81.28,34.54 R38.1 | C20.2 71.61,30.99 v71.12,30.99 | U1.30 104.58,21.52 106.17,23.11 v106.17,27.43
  Bottom 0.203: v71.12,30.99 74.68,30.99 v76.2,29.46 77.47,29.46 78.74,30.73 78.74,40.13 80.52,41.91 108.71,41.91 109.22,41.4 109.22,32.77 110.74,31.24 110.74,28.7 109.47,27.43 v106.17,27.43
N$67
  Top 0.203: U1.5 93.07,25.55 92.2,26.42 91.69,26.42 89.85,28.26 C8.1 86.87,26.74 L2.2
N$68
  Top 0.203: R41.1 arc90 69.09,30.29 69.09,33.53 68.58,34.04 U2.5
N$69  (via drill 3.2 pad 5)
  other vias: 5.08,20.32
N$70  (via drill 3.2 pad 5)
  other vias: 5.08,39.37
N$71
  Top 0.203: C24.1 67.39,37.7 U2.6
N$72  (via drill 0.35)
  Top 0.203: C24.2 65.09,36.76 65.79,36.07 65.79,34.29 65.53,34.04 64.52,34.04
  Top 0.406: v61.21,35.31 61.72,35.31 62.99,34.04 64.52,34.04 U2.2
  Bottom 0.406: L4.1 v61.21,35.31
N$73  (via drill 0.35)
  Top 0.203: R39.1 R40.2 64.77,41.59 v64.77,40.13 | v64.77,31.5 66.8,31.5 67.56,32.26 67.56,32.91 arc90 U2.4
  Top 0.406: R39.1 60.71,41.34
  Bottom 0.203: v64.77,40.13 v64.77,31.5
N$75  (via drill 3.2 pad 5)
  other vias: 123.19,39.37
N$76  (via drill 3.2 pad 5)
  other vias: 123.19,19.05
OK1  (via drill 0.35)
  Top 0.203: 96.27,10.23 v96.27,12.95 | v92.96,23.11 92.27,23.81 U1.6
  Top 0.406: R11.1 96.27,10.23
  Bottom 0.203: v96.27,12.95 94.23,14.99 94.23,21.84 v92.96,23.11
OK2  (via drill 0.35)
  Top 0.203: R12.1 102.36,11.75 v102.36,13.46 | v90.42,26.42 91.47,25.37 U1.7
  Bottom 0.203: v102.36,13.46 102.36,21.84 103.12,22.61 103.12,23.62 101.09,25.65 91.19,25.65 v90.42,26.42
OK3  (via drill 0.35)
  Top 0.203: R13.1 108.71,11.75 v108.71,13.46 | U1.8 88.65,26.65
  Top 0.406: v88.65,26.67 88.65,26.65
  Bottom 0.203: v88.65,26.67 89.92,27.94 99.82,27.94 108.71,19.05 v108.71,13.46
OK4  (via drill 0.35)
  Top 0.203: R14.1 115.64,10.67 v115.06,10.67 | v91.69,22.61 91.18,23.12 U1.9
  Bottom 0.203: v115.06,10.67 97.28,10.67 93.47,14.48 93.47,20.83 v91.69,22.61
OK5  (via drill 0.35)
  Top 0.203: R15.1 v120.4,9.65 | U1.10 90.46,22.32 v91.69,21.08
  Bottom 0.203: v120.4,9.65 96.77,9.65 92.71,13.72 92.71,20.07 v91.69,21.08
OK6  (via drill 0.35)  (1 unrouted)
  Top 0.203: v83.82,21.59 83.89,21.52 U1.11 | R16.1 43.43,9.91 43.94,10.41 43.94,14.48 44.96,15.49 70.36,15.49
  Bottom 0.203: v83.82,21.59 60.71,21.59
OK7  (via drill 0.35)
  Top 0.203: R17.1 50.04,12 v50.04,13.97 | v82.81,20.57 82.95,20.72 U1.12
  Bottom 0.203: v50.04,13.97 56.64,20.57 v82.8,20.57 v82.81,20.57
OK8  (via drill 0.35)  (1 unrouted)
  Top 0.203: v82.04,19.05 83.31,19.05 84.18,19.92 U1.13 | R18.1 55.12,9.91 56.64,8.38 67.82,8.38 v68.07,8.64
  Bottom 0.203: v82.04,19.05 81.28,19.81 v69.6,19.81 | v68.07,8.64 68.07,10.41 69.34,11.68 69.34,14.22
OK9
  Top 0.203: R19.1 62.16,11.43 68.33,11.43 69.85,12.95 91.95,12.95 93.87,14.88 U1.21
OK10
  Top 0.203: U1.22 94.67,14.66 91.95,11.94 69.85,11.94 68.07,10.16 R20.1
OK11  (via drill 0.35)
  Top 0.203: R7.1 6.6,10.16 6.86,10.41 v6.86,14.73 | v87.12,19.05 87.19,19.12 U1.14
  Bottom 0.203: v6.86,14.73 8.89,16.76 8.89,27.94 10.16,29.21 54.36,29.21 60.71,22.86 86.11,22.86 87.12,21.84 v87.12,19.05
OK12  (via drill 0.35)
  Top 0.203: R8.1 12.95,10.16 13.46,10.67 v13.46,13.46 | U1.15 86.07,18.32 v85.6,18.8
  Bottom 0.203: v13.46,13.46 13.46,14.73 12.45,15.75 10.16,15.75 9.65,16.26 9.65,27.43 10.92,28.7 54.1,28.7 60.45,22.35 85.09,22.35 85.6,21.84 v85.6,18.8
OK13  (via drill 0.35)  (1 unrouted)
  Top 0.203: 17.71,10.41 19.05,10.41 19.56,10.92 v19.56,11.68 | v98.56,6.85 98.8,6.85 100.33,8.38 100.33,10.92 99.06,12.19 99.06,15.48 100.08,16.5 100.08,17.78 99.54,18.32 U1.26 | v43.69,16 44.45,16
  Top 0.406: R9.1 17.71,10.41
  Bottom 0.203: 68.58,16.76 88.65,16.76 v98.56,6.85 | v19.56,11.68 20.07,11.18 24.38,11.18 25.91,12.7 36.83,12.7 38.86,10.67 43.18,10.67 43.69,11.18 v43.69,16
OK14  (via drill 0.35)
  Top 0.203: 23.05,10.16 v24.38,10.16 | v50.04,9.65 50.04,7.87 49.28,7.11 39.12,7.11 37.59,8.64 37.59,11.43 37.34,11.68 v31.5,11.68 | U1.27 96.45,19.12 96.27,19.3 96.27,21.84 95.76,22.35 93.98,22.35 93.22,21.59 93.22,21.08 91.95,19.81
  Top 0.406: R10.1 23.05,10.16 | v91.69,19.81 91.95,19.81
  Bottom 0.203: v91.69,19.81 89.41,17.53 58.67,17.53 57.91,16.76 55.12,16.76 53.34,14.99 53.34,11.43 50.55,11.43 50.04,10.92 v50.04,9.65 | v31.5,11.68 25.91,11.68 v24.38,10.16
V+
  Top 0.406: D2.A 38.34,23.64 39.62,22.35 41.15,22.35 C3.+ 43.18,20.3 39.9,17.02 D1.C 36.34,15.11 R21.2